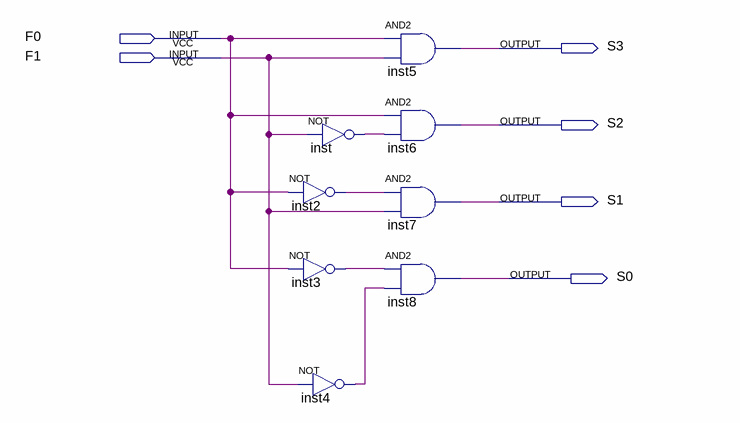
[diagram p0: schematic sheet]
// Quartus schematic DECODER_2T04.bdf as structural Verilog: 8 symbols, 6 pins
module DECODER_2T04 (
  input  F0,
  input  F1,
  output S3,
  output S2,
  output S1,
  output S0
);

  wire inst2_out, inst3_out, inst4_out, inst_out;

  not inst (inst_out, F1);
  not inst2 (inst2_out, F0);
  not inst3 (inst3_out, F0);
  not inst4 (inst4_out, F1);
  and inst5 (S3, F0, F1);
  and inst6 (S2, F0, inst_out);
  and inst7 (S1, inst2_out, F1);
  and inst8 (S0, inst3_out, inst4_out);
endmodule
